# EAGLE schematic Servosolenoidvalve_of_Tatebayashi (EAGLE 9.6.2)

## Sheet 1 of 3
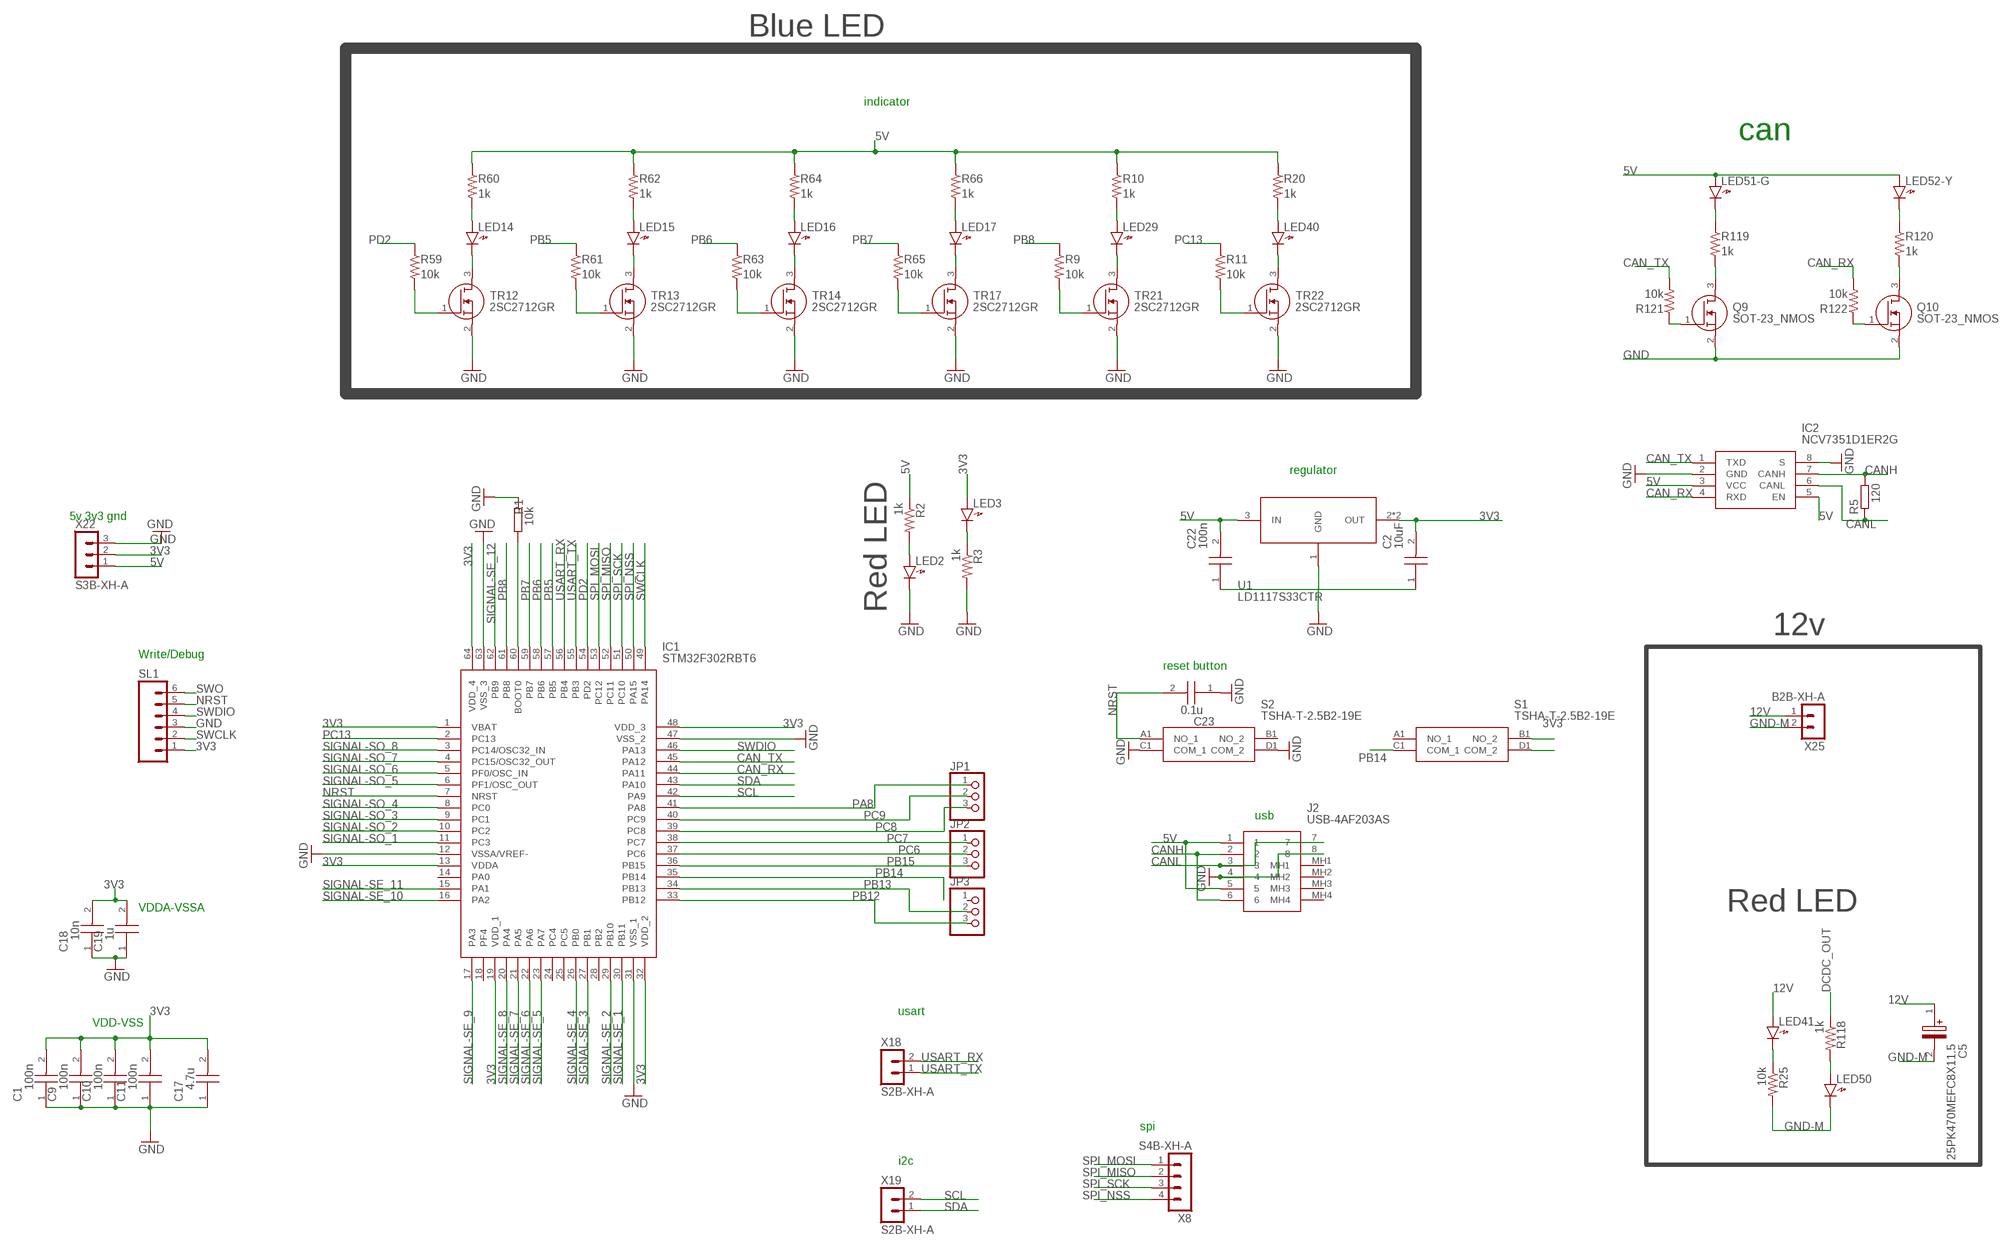
[diagram p0: schematic, sheet 1]

### Parts
C1  100n  AMK107BBJ476MA-RE  [CAPC1709X100N]
C2  10uF  GRM188B31A106KE69D  [CAPC1608X90N]
C5  25PK470MEFC8X11.5  [CAPPRD350W60D825H1150]
C9  100n  AMK107BBJ476MA-RE  [CAPC1709X100N]
C10  100n  AMK107BBJ476MA-RE  [CAPC1709X100N]
C11  100n  AMK107BBJ476MA-RE  [CAPC1709X100N]
C17  4.7u  AMK107BBJ476MA-RE  [CAPC1709X100N]
C18  10n  AMK107BBJ476MA-RE  [CAPC1709X100N]
C19  1u  AMK107BBJ476MA-RE  [CAPC1709X100N]
C22  100n  GRM188B31A106KE69D  [CAPC1608X90N]
C23  0.1u  AMK107BBJ476MA-RE  [CAPC1709X100N]
IC1  STM32F302RBT6  [QFP50P1200X1200X160-64N]
IC2  NCV7351D1ER2G  [SOIC127P600X175-8N]
J2  USB-4AF203AS  [USB4AF203AS]
JP1  PINHD-1X3  [1X03]
JP2  PINHD-1X3  [1X03]
JP3  PINHD-1X3  [1X03]
LED2  LED1608  [LED1608]
LED3  LED1608  [LED1608]
LED14  LED1608  [LED1608]
LED15  LED1608  [LED1608]
LED16  LED1608  [LED1608]
LED17  LED1608  [LED1608]
LED29  LED1608  [LED1608]
LED40  LED1608  [LED1608]
LED41  LED1608  [LED1608]
LED50  LED1608  [LED1608]
LED51-G  LED1608  [LED1608]
LED52-Y  LED1608  [LED1608]
Q9  SOT-23_NMOS  [SOT-23]
Q10  SOT-23_NMOS  [SOT-23]
R1  10k  R1608  [1608]
R2  1k  R-US_R0603  [R0603]
R3  1k  R-US_R0603  [R0603]
R5  120  R-EU_R0805  [R0805]
R9  10k  RESISTOR-US1608  [SMD1608]
R10  1k  RESISTOR-US1608  [SMD1608]
R11  10k  RESISTOR-US1608  [SMD1608]
R20  1k  RESISTOR-US1608  [SMD1608]
R25  10k  R-US_R0603  [R0603]
R59  10k  RESISTOR-US1608  [SMD1608]
R60  1k  RESISTOR-US1608  [SMD1608]
R61  10k  RESISTOR-US1608  [SMD1608]
R62  1k  RESISTOR-US1608  [SMD1608]
R63  10k  RESISTOR-US1608  [SMD1608]
R64  1k  RESISTOR-US1608  [SMD1608]
R65  10k  RESISTOR-US1608  [SMD1608]
R66  1k  RESISTOR-US1608  [SMD1608]
R118  1k  R-US_R0603  [R0603]
R119  1k  RESISTOR-US1608  [SMD1608]
R120  1k  RESISTOR-US1608  [SMD1608]
R121  10k  RESISTOR-US1608  [SMD1608]
R122  10k  RESISTOR-US1608  [SMD1608]
S1  TSHA-T-2.5B2-19E  [TSHAT25B219E]
S2  TSHA-T-2.5B2-19E  [TSHAT25B219E]
SL1  MA06  [06PA]
TR12  2SC2712GR  SOT-23_NMOS  [SOT-23]
TR13  2SC2712GR  SOT-23_NMOS  [SOT-23]
TR14  2SC2712GR  SOT-23_NMOS  [SOT-23]
TR17  2SC2712GR  SOT-23_NMOS  [SOT-23]
TR21  2SC2712GR  SOT-23_NMOS  [SOT-23]
TR22  2SC2712GR  SOT-23_NMOS  [SOT-23]
U1  LD1117S33CTR  [SOT223]
X8  S4B-XH-A  [S4B-XH-A]
X18  S2B-XH-A  [S2B-XH-A]
X19  S2B-XH-A  [S2B-XH-A]
X22  S3B-XH-A  [S3B-XH-A]
X25  B2B-XH-A  [B2B-XH-A]

### Nets
3V3: C1.2 C2.2 C9.2 C10.2 C11.2 C17.2 C18.2 C19.2 IC1.1(VBAT) IC1.13(VDDA) IC1.19(VDD_1) IC1.32(VDD_2) IC1.48(VDD_3) IC1.64(VDD_4) LED3.A S1.B1(NO_2) SL1.1 U1.2(OUT) U1.4(OUT) X22.2 ; also sheet 2,3
5V: C22.2 IC2.3(VCC) IC2.5(EN) J2.1 J2.5 LED51-G.A LED52-Y.A R2.1 R10.1 R20.1 R60.1 R62.1 R64.1 R66.1 U1.3(IN) X22.1
12V: C5.1(+) LED41.A X25.1 ; also sheet 2
CAN_RX: IC1.44(PA11) IC2.4(RXD) R122.2
CAN_TX: IC1.45(PA12) IC2.1(TXD) R121.2
CANH: IC2.7(CANH) J2.2 J2.6 R5.2
CANL: IC2.6(CANL) J2.3 J2.7 R5.1
DCDC_OUT: R118.1 ; also sheet 3
GND: C1.1 C2.1 C9.1 C10.1 C11.1 C17.1 C18.1 C19.1 C22.1 C23.1 IC1.12(VSSA/VREF-) IC1.31(VSS_1) IC1.47(VSS_2) IC1.63(VSS_3) IC2.2(GND) IC2.8(S) J2.4 J2.8 LED2.K Q9.2(S) Q10.2(S) R1.2 R3.2 S2.C1(COM_1) S2.D1(COM_2) SL1.3 TR12.2(S) TR13.2(S) TR14.2(S) TR17.2(S) TR21.2(S) TR22.2(S) U1.1(GND) X22.3 ; also sheet 2,3
GND-M: C5.2(-) LED50.K R25.2 X25.2 ; also sheet 2,3
N$7: LED2.A R2.2
N$8: LED3.K R3.1
N$15: IC1.60(BOOT0) R1.1
N$55: R59.2 TR12.1(G)
N$56: LED14.K TR12.3(D)
N$57: LED14.A R60.2
N$58: R61.2 TR13.1(G)
N$59: LED15.K TR13.3(D)
N$60: LED15.A R62.2
N$61: R63.2 TR14.1(G)
N$62: LED16.K TR14.3(D)
N$63: LED16.A R64.2
N$64: R65.2 TR17.1(G)
N$65: LED17.K TR17.3(D)
N$66: LED17.A R66.2
N$84: R9.2 TR21.1(G)
N$86: LED29.K TR21.3(D)
N$88: LED29.A R10.2
N$89: R11.2 TR22.1(G)
N$90: LED40.K TR22.3(D)
N$91: LED40.A R20.2
N$92: LED41.K R25.1
N$103: Q9.1(G) R121.1
N$104: Q10.1(G) R122.1
N$105: LED51-G.K R119.1
N$106: LED52-Y.K R120.1
N$107: LED50.A R118.2
N$108: Q9.3(D) R119.2
N$109: Q10.3(D) R120.2
N$113: S1.D1(COM_2)
NRST: C23.2 IC1.7(NRST) S2.A1(NO_1) SL1.5
PA8: IC1.41(PA8) JP1.1
PB5: IC1.57(PB5) R61.1
PB6: IC1.58(PB6) R63.1
PB7: IC1.59(PB7) R65.1
PB8: IC1.61(PB8) R9.1
PB12: IC1.33(PB12) JP3.3
PB13: IC1.34(PB13) JP3.2
PB14: IC1.35(PB14) S1.C1(COM_1)
PB15: IC1.36(PB15) JP2.3
PC6: IC1.37(PC6) JP2.2
PC7: IC1.38(PC7) JP2.1
PC8: IC1.39(PC8) JP1.3
PC9: IC1.40(PC9) JP1.2
PC13: IC1.2(PC13) R11.1
PD2: IC1.54(PD2) R59.1
SCL: IC1.42(PA9) X19.2
SDA: IC1.43(PA10) X19.1
SIGNAL-SE_1: IC1.30(PB11) ; also sheet 3
SIGNAL-SE_2: IC1.29(PB10) ; also sheet 3
SIGNAL-SE_3: IC1.27(PB1) ; also sheet 3
SIGNAL-SE_4: IC1.26(PB0) ; also sheet 3
SIGNAL-SE_5: IC1.23(PA7) ; also sheet 3
SIGNAL-SE_6: IC1.22(PA6) ; also sheet 3
SIGNAL-SE_7: IC1.21(PA5) ; also sheet 3
SIGNAL-SE_8: IC1.20(PA4) ; also sheet 3
SIGNAL-SE_9: IC1.17(PA3) ; also sheet 3
SIGNAL-SE_10: IC1.16(PA2) ; also sheet 3
SIGNAL-SE_11: IC1.15(PA1) ; also sheet 3
SIGNAL-SE_12: IC1.62(PB9) ; also sheet 3
SIGNAL-SO_1: IC1.11(PC3) ; also sheet 2
SIGNAL-SO_2: IC1.10(PC2) ; also sheet 2
SIGNAL-SO_3: IC1.9(PC1) ; also sheet 2
SIGNAL-SO_4: IC1.8(PC0) ; also sheet 2
SIGNAL-SO_5: IC1.6(PF1/OSC_OUT) ; also sheet 2
SIGNAL-SO_6: IC1.5(PF0/OSC_IN) ; also sheet 2
SIGNAL-SO_7: IC1.4(PC15/OSC32_OUT) ; also sheet 2
SIGNAL-SO_8: IC1.3(PC14/OSC32_IN) ; also sheet 2
SPI_MISO: IC1.52(PC11) X8.2
SPI_MOSI: IC1.53(PC12) X8.1
SPI_NSS: IC1.50(PA15) X8.4
SPI_SCK: IC1.51(PC10) X8.3
SWCLK: IC1.49(PA14) SL1.2
SWDIO: IC1.46(PA13) SL1.4
SWO: SL1.6
USART_RX: IC1.56(PB4) X18.2
USART_TX: IC1.55(PB3) X18.1
Unconnected: IC1.14(PA0) IC1.18(PF4) IC1.24(PC4) IC1.25(PC5) IC1.28(PB2) J2.MH1 J2.MH2 J2.MH3 J2.MH4 JP3.1 S1.A1(NO_1) S2.B1(NO_2)

### Notes on the sheet
- Blue LED
- indicator
- can
- regulator
- 5v 3v3 gnd
- Red LED
- 12v
- Write/Debug
- reset button
- usb
- VDDA-VSSA | Red LED
- usart
- VDD-VSS
- spi
- i2c

## Sheet 2 of 3
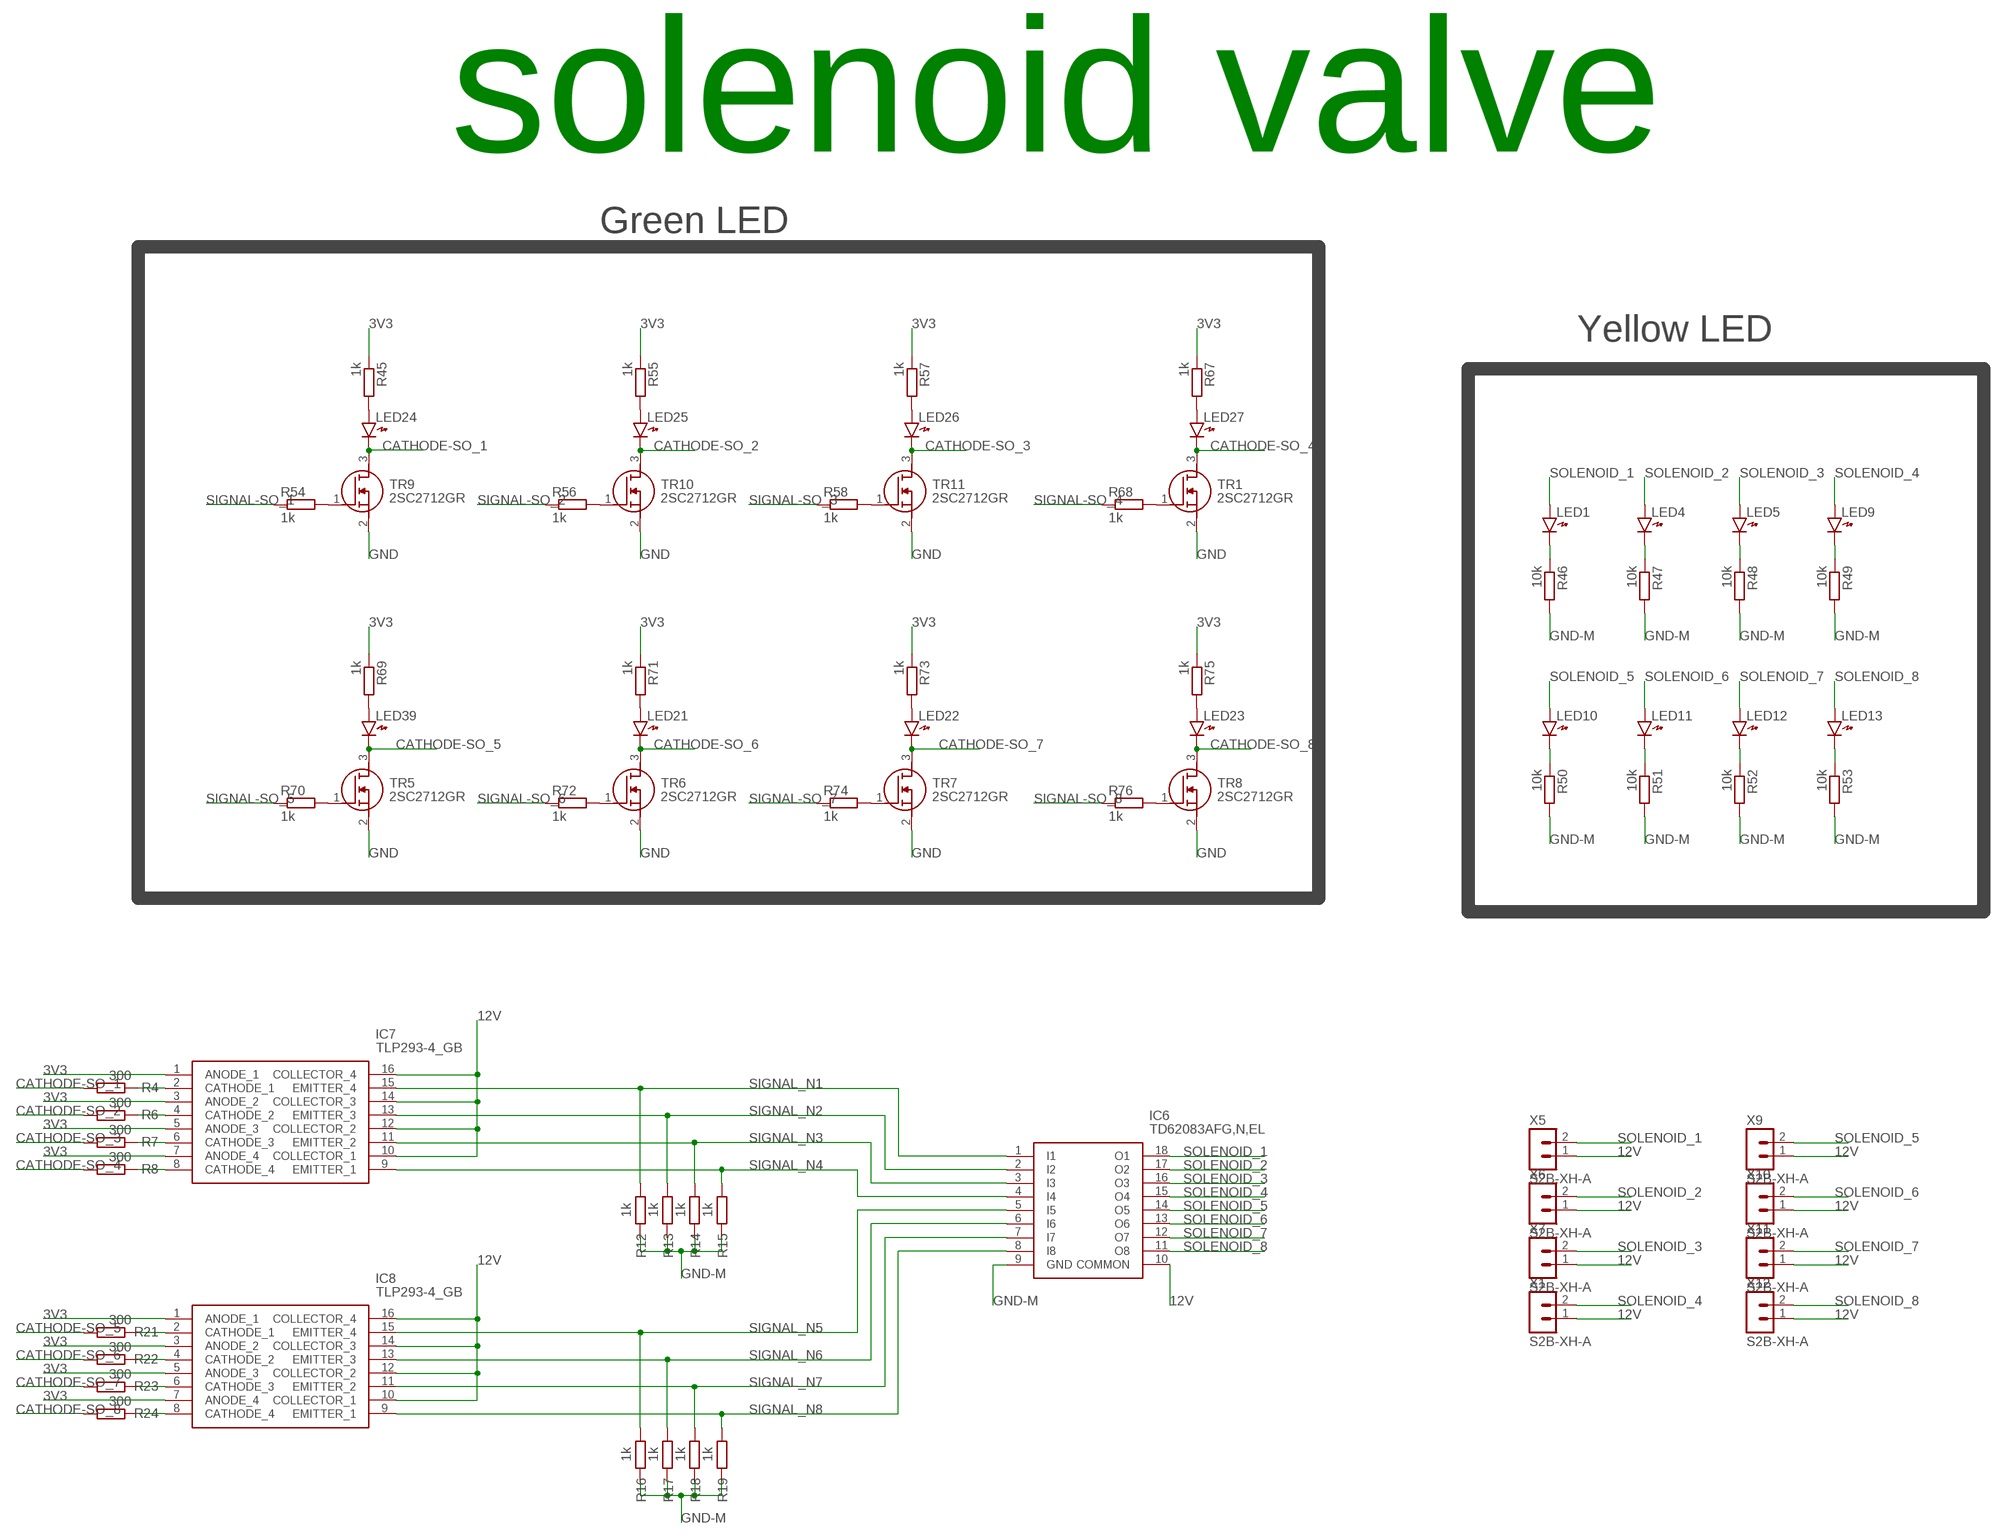
[diagram p1: schematic, sheet 2]

### Parts
IC6  TD62083AFG,N,EL  [SOIC127P1030X245-18N]
IC7  TLP293-4_GB  [SOP128P700X220-16N]
IC8  TLP293-4_GB  [SOP128P700X220-16N]
LED1  LED1608  [LED1608]
LED4  LED1608  [LED1608]
LED5  LED1608  [LED1608]
LED9  LED1608  [LED1608]
LED10  LED1608  [LED1608]
LED11  LED1608  [LED1608]
LED12  LED1608  [LED1608]
LED13  LED1608  [LED1608]
LED21  LED1608  [LED1608]
LED22  LED1608  [LED1608]
LED23  LED1608  [LED1608]
LED24  LED1608  [LED1608]
LED25  LED1608  [LED1608]
LED26  LED1608  [LED1608]
LED27  LED1608  [LED1608]
LED39  LED1608  [LED1608]
R4  300  R-EU_R0603  [R0603]
R6  300  R-EU_R0603  [R0603]
R7  300  R-EU_R0603  [R0603]
R8  300  R-EU_R0603  [R0603]
R12  1k  R-EU_R0603  [R0603]
R13  1k  R-EU_R0603  [R0603]
R14  1k  R-EU_R0603  [R0603]
R15  1k  R-EU_R0603  [R0603]
R16  1k  R-EU_R0603  [R0603]
R17  1k  R-EU_R0603  [R0603]
R18  1k  R-EU_R0603  [R0603]
R19  1k  R-EU_R0603  [R0603]
R21  300  R-EU_R0603  [R0603]
R22  300  R-EU_R0603  [R0603]
R23  300  R-EU_R0603  [R0603]
R24  300  R-EU_R0603  [R0603]
R45  1k  R-EU_R0603  [R0603]
R46  10k  R-EU_R0603  [R0603]
R47  10k  R-EU_R0603  [R0603]
R48  10k  R-EU_R0603  [R0603]
R49  10k  R-EU_R0603  [R0603]
R50  10k  R-EU_R0603  [R0603]
R51  10k  R-EU_R0603  [R0603]
R52  10k  R-EU_R0603  [R0603]
R53  10k  R-EU_R0603  [R0603]
R54  1k  R-EU_R0603  [R0603]
R55  1k  R-EU_R0603  [R0603]
R56  1k  R-EU_R0603  [R0603]
R57  1k  R-EU_R0603  [R0603]
R58  1k  R-EU_R0603  [R0603]
R67  1k  R-EU_R0603  [R0603]
R68  1k  R-EU_R0603  [R0603]
R69  1k  R-EU_R0603  [R0603]
R70  1k  R-EU_R0603  [R0603]
R71  1k  R-EU_R0603  [R0603]
R72  1k  R-EU_R0603  [R0603]
R73  1k  R-EU_R0603  [R0603]
R74  1k  R-EU_R0603  [R0603]
R75  1k  R-EU_R0603  [R0603]
R76  1k  R-EU_R0603  [R0603]
TR1  2SC2712GR  SOT-23_NMOS  [SOT-23]
TR5  2SC2712GR  SOT-23_NMOS  [SOT-23]
TR6  2SC2712GR  SOT-23_NMOS  [SOT-23]
TR7  2SC2712GR  SOT-23_NMOS  [SOT-23]
TR8  2SC2712GR  SOT-23_NMOS  [SOT-23]
TR9  2SC2712GR  SOT-23_NMOS  [SOT-23]
TR10  2SC2712GR  SOT-23_NMOS  [SOT-23]
TR11  2SC2712GR  SOT-23_NMOS  [SOT-23]
X1  S2B-XH-A  [S2B-XH-A]
X5  S2B-XH-A  [S2B-XH-A]
X6  S2B-XH-A  [S2B-XH-A]
X7  S2B-XH-A  [S2B-XH-A]
X9  S2B-XH-A  [S2B-XH-A]
X10  S2B-XH-A  [S2B-XH-A]
X11  S2B-XH-A  [S2B-XH-A]
X12  S2B-XH-A  [S2B-XH-A]

### Nets
3V3: IC7.1(ANODE_1) IC7.3(ANODE_2) IC7.5(ANODE_3) IC7.7(ANODE_4) IC8.1(ANODE_1) IC8.3(ANODE_2) IC8.5(ANODE_3) IC8.7(ANODE_4) R45.1 R55.1 R57.1 R67.1 R69.1 R71.1 R73.1 R75.1 ; also sheet 1,3
12V: IC6.10(COMMON) IC7.10(COLLECTOR_1) IC7.12(COLLECTOR_2) IC7.14(COLLECTOR_3) IC7.16(COLLECTOR_4) IC8.10(COLLECTOR_1) IC8.12(COLLECTOR_2) IC8.14(COLLECTOR_3) IC8.16(COLLECTOR_4) X1.1 X5.1 X6.1 X7.1 X9.1 X10.1 X11.1 X12.1 ; also sheet 1
CATHODE-SO_1: LED24.K R4.2 TR9.3(D)
CATHODE-SO_2: LED25.K R6.2 TR10.3(D)
CATHODE-SO_3: LED26.K R7.2 TR11.3(D)
CATHODE-SO_4: LED27.K R8.2 TR1.3(D)
CATHODE-SO_5: LED39.K R21.2 TR5.3(D)
CATHODE-SO_6: LED21.K R22.2 TR6.3(D)
CATHODE-SO_7: LED22.K R23.2 TR7.3(D)
CATHODE-SO_8: LED23.K R24.2 TR8.3(D)
GND: TR1.2(S) TR5.2(S) TR6.2(S) TR7.2(S) TR8.2(S) TR9.2(S) TR10.2(S) TR11.2(S) ; also sheet 1,3
GND-M: IC6.9(GND) R12.1 R13.1 R14.1 R15.1 R16.1 R17.1 R18.1 R19.1 R46.2 R47.2 R48.2 R49.2 R50.2 R51.2 R52.2 R53.2 ; also sheet 1,3
N$4: IC7.2(CATHODE_1) R4.1
N$5: IC7.4(CATHODE_2) R6.1
N$6: IC7.6(CATHODE_3) R7.1
N$10: IC7.8(CATHODE_4) R8.1
N$11: LED24.A R45.2
N$12: LED25.A R55.2
N$13: LED26.A R57.2
N$14: LED27.A R67.2
N$16: IC8.2(CATHODE_1) R21.1
N$17: IC8.4(CATHODE_2) R22.1
N$18: R54.2 TR9.1(G)
N$19: LED39.A R69.2
N$20: R68.2 TR1.1(G)
N$21: LED21.A R71.2
N$22: IC8.6(CATHODE_3) R23.1
N$23: IC8.8(CATHODE_4) R24.1
N$24: LED22.A R73.2
N$25: LED23.A R75.2
N$32: R70.2 TR5.1(G)
N$34: R72.2 TR6.1(G)
N$35: R74.2 TR7.1(G)
N$39: R76.2 TR8.1(G)
N$41: R56.2 TR10.1(G)
N$44: R58.2 TR11.1(G)
N$45: LED1.K R46.1
N$46: LED4.K R47.1
N$47: LED5.K R48.1
N$48: LED9.K R49.1
N$49: LED10.K R50.1
N$50: LED11.K R51.1
N$51: LED12.K R52.1
N$52: LED13.K R53.1
SIGNAL-SO_1: R54.1 ; also sheet 1
SIGNAL-SO_2: R56.1 ; also sheet 1
SIGNAL-SO_3: R58.1 ; also sheet 1
SIGNAL-SO_4: R68.1 ; also sheet 1
SIGNAL-SO_5: R70.1 ; also sheet 1
SIGNAL-SO_6: R72.1 ; also sheet 1
SIGNAL-SO_7: R74.1 ; also sheet 1
SIGNAL-SO_8: R76.1 ; also sheet 1
SIGNAL_N1: IC6.1(I1) IC7.15(EMITTER_4) R12.2
SIGNAL_N2: IC6.2(I2) IC7.13(EMITTER_3) R13.2
SIGNAL_N3: IC6.3(I3) IC7.11(EMITTER_2) R14.2
SIGNAL_N4: IC6.4(I4) IC7.9(EMITTER_1) R15.2
SIGNAL_N5: IC6.5(I5) IC8.15(EMITTER_4) R16.2
SIGNAL_N6: IC6.6(I6) IC8.13(EMITTER_3) R17.2
SIGNAL_N7: IC6.7(I7) IC8.11(EMITTER_2) R18.2
SIGNAL_N8: IC6.8(I8) IC8.9(EMITTER_1) R19.2
SOLENOID_1: IC6.18(O1) LED1.A X5.2
SOLENOID_2: IC6.17(O2) LED4.A X6.2
SOLENOID_3: IC6.16(O3) LED5.A X7.2
SOLENOID_4: IC6.15(O4) LED9.A X1.2
SOLENOID_5: IC6.14(O5) LED10.A X9.2
SOLENOID_6: IC6.13(O6) LED11.A X10.2
SOLENOID_7: IC6.12(O7) LED12.A X11.2
SOLENOID_8: IC6.11(O8) LED13.A X12.2

### Notes on the sheet
- solenoid valve
- Green LED
- Yellow LED

## Sheet 3 of 3
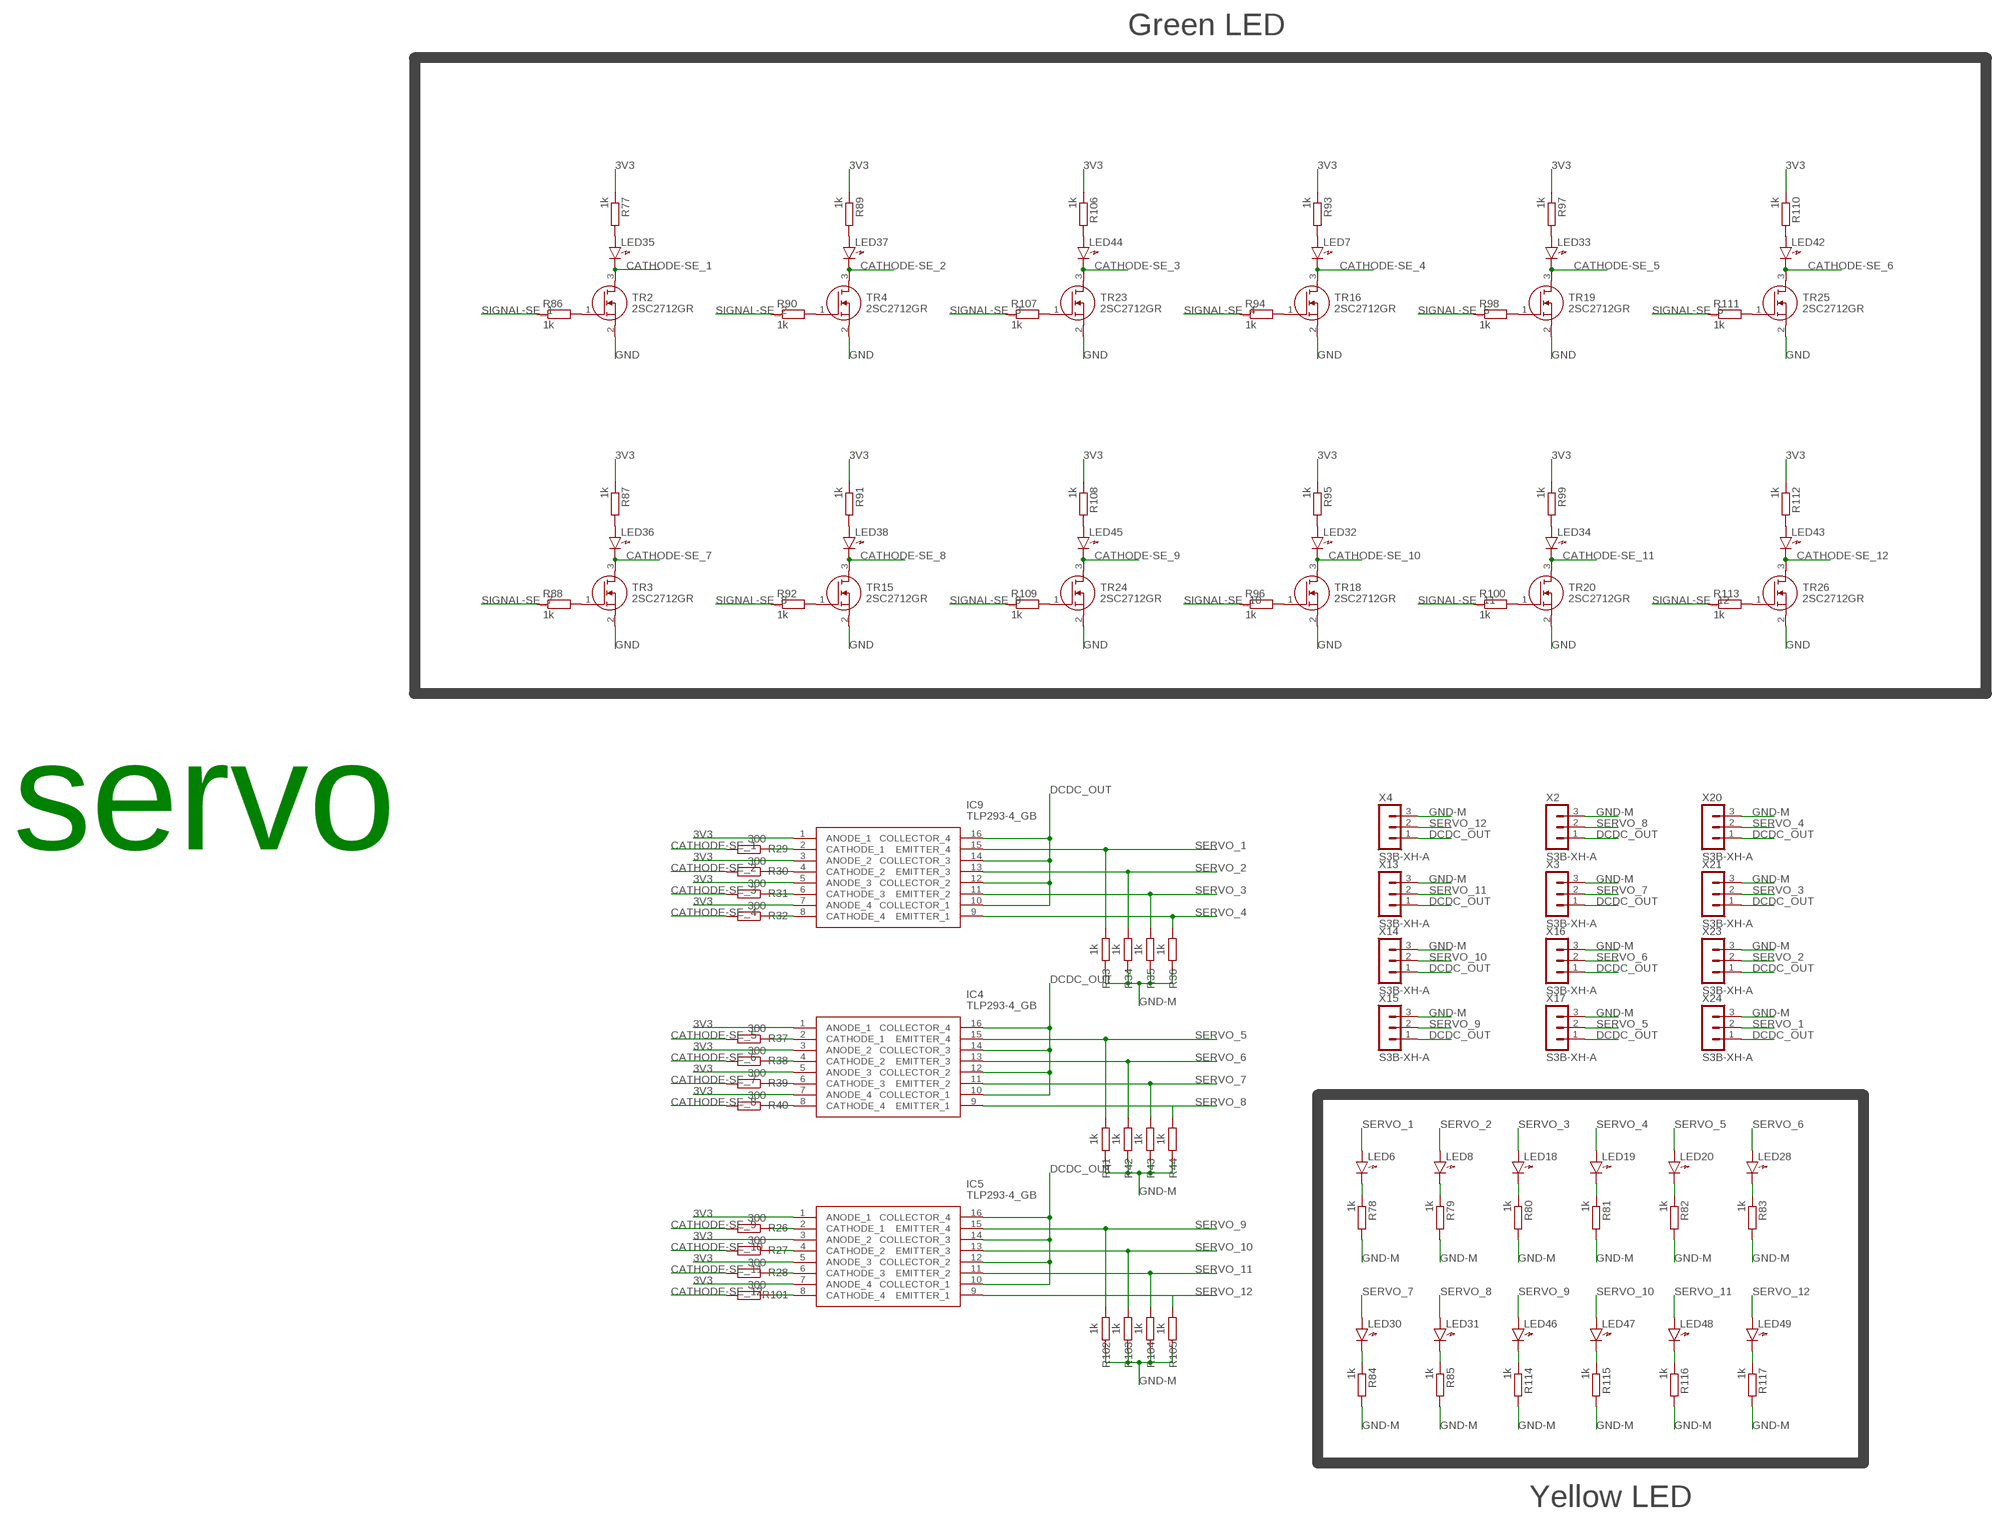
[diagram p2: schematic, sheet 3]

### Parts
IC4  TLP293-4_GB  [SOP128P700X220-16N]
IC5  TLP293-4_GB  [SOP128P700X220-16N]
IC9  TLP293-4_GB  [SOP128P700X220-16N]
LED6  LED1608  [LED1608]
LED7  LED1608  [LED1608]
LED8  LED1608  [LED1608]
LED18  LED1608  [LED1608]
LED19  LED1608  [LED1608]
LED20  LED1608  [LED1608]
LED28  LED1608  [LED1608]
LED30  LED1608  [LED1608]
LED31  LED1608  [LED1608]
LED32  LED1608  [LED1608]
LED33  LED1608  [LED1608]
LED34  LED1608  [LED1608]
LED35  LED1608  [LED1608]
LED36  LED1608  [LED1608]
LED37  LED1608  [LED1608]
LED38  LED1608  [LED1608]
LED42  LED1608  [LED1608]
LED43  LED1608  [LED1608]
LED44  LED1608  [LED1608]
LED45  LED1608  [LED1608]
LED46  LED1608  [LED1608]
LED47  LED1608  [LED1608]
LED48  LED1608  [LED1608]
LED49  LED1608  [LED1608]
R26  300  R-EU_R0603  [R0603]
R27  300  R-EU_R0603  [R0603]
R28  300  R-EU_R0603  [R0603]
R29  300  R-EU_R0603  [R0603]
R30  300  R-EU_R0603  [R0603]
R31  300  R-EU_R0603  [R0603]
R32  300  R-EU_R0603  [R0603]
R33  1k  R-EU_R0603  [R0603]
R34  1k  R-EU_R0603  [R0603]
R35  1k  R-EU_R0603  [R0603]
R36  1k  R-EU_R0603  [R0603]
R37  300  R-EU_R0603  [R0603]
R38  300  R-EU_R0603  [R0603]
R39  300  R-EU_R0603  [R0603]
R40  300  R-EU_R0603  [R0603]
R41  1k  R-EU_R0603  [R0603]
R42  1k  R-EU_R0603  [R0603]
R43  1k  R-EU_R0603  [R0603]
R44  1k  R-EU_R0603  [R0603]
R77  1k  R-EU_R0603  [R0603]
R78  1k  R-EU_R0603  [R0603]
R79  1k  R-EU_R0603  [R0603]
R80  1k  R-EU_R0603  [R0603]
R81  1k  R-EU_R0603  [R0603]
R82  1k  R-EU_R0603  [R0603]
R83  1k  R-EU_R0603  [R0603]
R84  1k  R-EU_R0603  [R0603]
R85  1k  R-EU_R0603  [R0603]
R86  1k  R-EU_R0603  [R0603]
R87  1k  R-EU_R0603  [R0603]
R88  1k  R-EU_R0603  [R0603]
R89  1k  R-EU_R0603  [R0603]
R90  1k  R-EU_R0603  [R0603]
R91  1k  R-EU_R0603  [R0603]
R92  1k  R-EU_R0603  [R0603]
R93  1k  R-EU_R0603  [R0603]
R94  1k  R-EU_R0603  [R0603]
R95  1k  R-EU_R0603  [R0603]
R96  1k  R-EU_R0603  [R0603]
R97  1k  R-EU_R0603  [R0603]
R98  1k  R-EU_R0603  [R0603]
R99  1k  R-EU_R0603  [R0603]
R100  1k  R-EU_R0603  [R0603]
R101  300  R-EU_R0603  [R0603]
R102  1k  R-EU_R0603  [R0603]
R103  1k  R-EU_R0603  [R0603]
R104  1k  R-EU_R0603  [R0603]
R105  1k  R-EU_R0603  [R0603]
R106  1k  R-EU_R0603  [R0603]
R107  1k  R-EU_R0603  [R0603]
R108  1k  R-EU_R0603  [R0603]
R109  1k  R-EU_R0603  [R0603]
R110  1k  R-EU_R0603  [R0603]
R111  1k  R-EU_R0603  [R0603]
R112  1k  R-EU_R0603  [R0603]
R113  1k  R-EU_R0603  [R0603]
R114  1k  R-EU_R0603  [R0603]
R115  1k  R-EU_R0603  [R0603]
R116  1k  R-EU_R0603  [R0603]
R117  1k  R-EU_R0603  [R0603]
TR2  2SC2712GR  SOT-23_NMOS  [SOT-23]
TR3  2SC2712GR  SOT-23_NMOS  [SOT-23]
TR4  2SC2712GR  SOT-23_NMOS  [SOT-23]
TR15  2SC2712GR  SOT-23_NMOS  [SOT-23]
TR16  2SC2712GR  SOT-23_NMOS  [SOT-23]
TR18  2SC2712GR  SOT-23_NMOS  [SOT-23]
TR19  2SC2712GR  SOT-23_NMOS  [SOT-23]
TR20  2SC2712GR  SOT-23_NMOS  [SOT-23]
TR23  2SC2712GR  SOT-23_NMOS  [SOT-23]
TR24  2SC2712GR  SOT-23_NMOS  [SOT-23]
TR25  2SC2712GR  SOT-23_NMOS  [SOT-23]
TR26  2SC2712GR  SOT-23_NMOS  [SOT-23]
X2  S3B-XH-A  [S3B-XH-A]
X3  S3B-XH-A  [S3B-XH-A]
X4  S3B-XH-A  [S3B-XH-A]
X13  S3B-XH-A  [S3B-XH-A]
X14  S3B-XH-A  [S3B-XH-A]
X15  S3B-XH-A  [S3B-XH-A]
X16  S3B-XH-A  [S3B-XH-A]
X17  S3B-XH-A  [S3B-XH-A]
X20  S3B-XH-A  [S3B-XH-A]
X21  S3B-XH-A  [S3B-XH-A]
X23  S3B-XH-A  [S3B-XH-A]
X24  S3B-XH-A  [S3B-XH-A]

### Nets
3V3: IC4.1(ANODE_1) IC4.3(ANODE_2) IC4.5(ANODE_3) IC4.7(ANODE_4) IC5.1(ANODE_1) IC5.3(ANODE_2) IC5.5(ANODE_3) IC5.7(ANODE_4) IC9.1(ANODE_1) IC9.3(ANODE_2) IC9.5(ANODE_3) IC9.7(ANODE_4) R77.1 R87.1 R89.1 R91.1 R93.1 R95.1 R97.1 R99.1 R106.1 R108.1 R110.1 R112.1 ; also sheet 1,2
CATHODE-SE_1: LED35.K R29.2 TR2.3(D)
CATHODE-SE_2: LED37.K R30.2 TR4.3(D)
CATHODE-SE_3: LED44.K R31.2 TR23.3(D)
CATHODE-SE_4: LED7.K R32.2 TR16.3(D)
CATHODE-SE_5: LED33.K R37.2 TR19.3(D)
CATHODE-SE_6: LED42.K R38.2 TR25.3(D)
CATHODE-SE_7: LED36.K R39.2 TR3.3(D)
CATHODE-SE_8: LED38.K R40.2 TR15.3(D)
CATHODE-SE_9: LED45.K R26.2 TR24.3(D)
CATHODE-SE_10: LED32.K R27.2 TR18.3(D)
CATHODE-SE_11: LED34.K R28.2 TR20.3(D)
CATHODE-SE_12: LED43.K R101.2 TR26.3(D)
DCDC_OUT: IC4.10(COLLECTOR_1) IC4.12(COLLECTOR_2) IC4.14(COLLECTOR_3) IC4.16(COLLECTOR_4) IC5.10(COLLECTOR_1) IC5.12(COLLECTOR_2) IC5.14(COLLECTOR_3) IC5.16(COLLECTOR_4) IC9.10(COLLECTOR_1) IC9.12(COLLECTOR_2) IC9.14(COLLECTOR_3) IC9.16(COLLECTOR_4) X2.1 X3.1 X4.1 X13.1 X14.1 X15.1 X16.1 X17.1 X20.1 X21.1 X23.1 X24.1 ; also sheet 1
GND: TR2.2(S) TR3.2(S) TR4.2(S) TR15.2(S) TR16.2(S) TR18.2(S) TR19.2(S) TR20.2(S) TR23.2(S) TR24.2(S) TR25.2(S) TR26.2(S) ; also sheet 1,2
GND-M: R33.1 R34.1 R35.1 R36.1 R41.1 R42.1 R43.1 R44.1 R78.2 R79.2 R80.2 R81.2 R82.2 R83.2 R84.2 R85.2 R102.1 R103.1 R104.1 R105.1 R114.2 R115.2 R116.2 R117.2 X2.3 X3.3 X4.3 X13.3 X14.3 X15.3 X16.3 X17.3 X20.3 X21.3 X23.3 X24.3 ; also sheet 1,2
N$1: IC4.2(CATHODE_1) R37.1
N$2: IC4.4(CATHODE_2) R38.1
N$3: IC4.6(CATHODE_3) R39.1
N$9: IC4.8(CATHODE_4) R40.1
N$26: R86.2 TR2.1(G)
N$27: R88.2 TR3.1(G)
N$28: IC9.2(CATHODE_1) R29.1
N$29: IC9.4(CATHODE_2) R30.1
N$30: IC9.6(CATHODE_3) R31.1
N$31: IC9.8(CATHODE_4) R32.1
N$33: R90.2 TR4.1(G)
N$36: R92.2 TR15.1(G)
N$37: R94.2 TR16.1(G)
N$38: R96.2 TR18.1(G)
N$40: R98.2 TR19.1(G)
N$42: R100.2 TR20.1(G)
N$43: IC5.2(CATHODE_1) R26.1
N$53: LED6.K R78.1
N$54: LED8.K R79.1
N$67: LED18.K R80.1
N$68: LED19.K R81.1
N$69: LED20.K R82.1
N$70: LED28.K R83.1
N$71: LED30.K R84.1
N$72: LED31.K R85.1
N$73: LED35.A R77.2
N$74: IC5.4(CATHODE_2) R27.1
N$75: LED36.A R87.2
N$76: IC5.6(CATHODE_3) R28.1
N$77: LED37.A R89.2
N$78: IC5.8(CATHODE_4) R101.1
N$79: LED38.A R91.2
N$80: LED7.A R93.2
N$81: LED32.A R95.2
N$82: LED33.A R97.2
N$83: LED34.A R99.2
N$85: R107.2 TR23.1(G)
N$87: R109.2 TR24.1(G)
N$93: R111.2 TR25.1(G)
N$94: R113.2 TR26.1(G)
N$95: LED44.A R106.2
N$96: LED45.A R108.2
N$97: LED42.A R110.2
N$98: LED43.A R112.2
N$99: LED46.K R114.1
N$100: LED47.K R115.1
N$101: LED48.K R116.1
N$102: LED49.K R117.1
SERVO_1: IC9.15(EMITTER_4) LED6.A R33.2 X24.2
SERVO_2: IC9.13(EMITTER_3) LED8.A R34.2 X23.2
SERVO_3: IC9.11(EMITTER_2) LED18.A R35.2 X21.2
SERVO_4: IC9.9(EMITTER_1) LED19.A R36.2 X20.2
SERVO_5: IC4.15(EMITTER_4) LED20.A R41.2 X17.2
SERVO_6: IC4.13(EMITTER_3) LED28.A R42.2 X16.2
SERVO_7: IC4.11(EMITTER_2) LED30.A R43.2 X3.2
SERVO_8: IC4.9(EMITTER_1) LED31.A R44.2 X2.2
SERVO_9: IC5.15(EMITTER_4) LED46.A R102.2 X15.2
SERVO_10: IC5.13(EMITTER_3) LED47.A R103.2 X14.2
SERVO_11: IC5.11(EMITTER_2) LED48.A R104.2 X13.2
SERVO_12: IC5.9(EMITTER_1) LED49.A R105.2 X4.2
SIGNAL-SE_1: R86.1 ; also sheet 1
SIGNAL-SE_2: R90.1 ; also sheet 1
SIGNAL-SE_3: R107.1 ; also sheet 1
SIGNAL-SE_4: R94.1 ; also sheet 1
SIGNAL-SE_5: R98.1 ; also sheet 1
SIGNAL-SE_6: R111.1 ; also sheet 1
SIGNAL-SE_7: R88.1 ; also sheet 1
SIGNAL-SE_8: R92.1 ; also sheet 1
SIGNAL-SE_9: R109.1 ; also sheet 1
SIGNAL-SE_10: R96.1 ; also sheet 1
SIGNAL-SE_11: R100.1 ; also sheet 1
SIGNAL-SE_12: R113.1 ; also sheet 1

### Notes on the sheet
- Green LED
- servo
- Yellow LED

## Library data of the parts
C1 C9-C11 C17-C19 C23 = SamacSys_Parts:AMK107BBJ476MA-RE: 0603 (1608M) 47uF MLCC 4V dc +/-20% SMD Source: Datasheet <https://ds.yuden.co.jp/TYCOMPAS/ut/detail?pn=AMK107BBJ476MA-RE&u=M>; DESCRIPTION: 0603 (1608M) 47uF MLCC 4V dc +/-20% SMD; HEIGHT: 1mm; MANUFACTURER_NAME: TAIYO YUDEN; MANUFACTURER_PART_NUMBER: AMK107BBJ476MA-RE; MOUSER_PART_NUMBER: 963-AMK107BBJ476MARE; MOUSER_PRICE-STOCK: https://www.mouser.com/Search/Refine.aspx?Keyword=963-AMK107BBJ476MARE; RS_PART_NUMBER: 1843762P; RS_PRICE-STOCK: http://uk.rs-online.com/web/p/products/1843762P
C2 C22 = SamacSys_Parts:GRM188B31A106KE69D: Murata 1608 GRM 10000nF Ceramic Multilayer Capacitor, 10 V dc, +85C, B Dielectric, +/-10% Source: Datasheet <http://www.murata.com/~/media/webrenewal/support/library/catalog/products/capacitor/mlcc/c02e.pdf>; DESCRIPTION: Murata 1608 GRM 10000nF Ceramic Multilayer Capacitor, 10 V dc, +85C, B Dielectric, +/-10%; HEIGHT: 0.9mm; MANUFACTURER_NAME: Murata Electronics; MANUFACTURER_PART_NUMBER: GRM188B31A106KE69D; RS_PART_NUMBER: 8847157P; RS_PRICE-STOCK: http://uk.rs-online.com/web/p/products/8847157P
C5 = SamacSys_Parts:25PK470MEFC8X11.5: Rubycon 470uF 25 V dc Aluminium Electrolytic Capacitor, PK Series 2000h 8 Dia. x 11.5mm Source: Datasheet <http://www.rubycon.co.jp/en/catalog/e_pdfs/aluminum/e_pk.pdf>; DESCRIPTION: Rubycon 470uF 25 V dc Aluminium Electrolytic Capacitor, PK Series 2000h 8 Dia. x 11.5mm; HEIGHT: 11.5mm; MANUFACTURER_NAME: Rubycon; MANUFACTURER_PART_NUMBER: 25PK470MEFC8X11.5; MOUSER_PART_NUMBER: 232-25PK470MEFC8X115; MOUSER_PRICE-STOCK: https://www.mouser.co.uk/ProductDetail/Rubycon/25PK470MEFC8X115?qs=T3oQrply3y%252BFwMonqVFqXg%3D%3D
IC1 = SamacSys_Parts:STM32F302RBT6: STMicroelectronics, STM32F302RBT6 STM32F302RBT6, 32 bit ARM Cortex M4 MCU 72MHz 128 kB Flash, 32 kB RAM, USB CAN I2C 64-Pin LQFP Source: Datasheet <http://www.st.com/web/en/resource/technical/document/datasheet/DM00094064.pdf>; ARROW_PART_NUMBER: STM32F302RBT6; ARROW_PRICE-STOCK: https://www.arrow.com/en/products/stm32f302rbt6/stmicroelectronics; DESCRIPTION: STMicroelectronics, STM32F302RBT6 STM32F302RBT6, 32 bit ARM Cortex M4 MCU 72MHz 128 kB Flash, 32 kB RAM, USB CAN I2C 64-Pin LQFP; HEIGHT: 1.6mm; MANUFACTURER_NAME: STMicroelectronics; MANUFACTURER_PART_NUMBER: STM32F302RBT6; MOUSER_PART_NUMBER: 511-STM32F302RBT6; MOUSER_PRICE-STOCK: https://www.mouser.co.uk/ProductDetail/STMicroelectronics/STM32F302RBT6?qs=MgMGkPeFqc%252BEgXCc%2F%2FVW1w%3D%3D
IC2 = SamacSys_Parts:NCV7351D1ER2G: ON Semiconductor NCV7351D1ER2G, CAN Transceiver 1Mbit/s 1-channel ISO 11898-2, 8-Pin SOIC Source: Datasheet <http://www.onsemi.com/pub/Collateral/NCV7351-D.PDF>; ARROW_PART_NUMBER: NCV7351D1ER2G; ARROW_PRICE-STOCK: https://www.arrow.com/en/products/ncv7351d1er2g/on-semiconductor; DESCRIPTION: ON Semiconductor NCV7351D1ER2G, CAN Transceiver 1Mbit/s 1-channel ISO 11898-2, 8-Pin SOIC; HEIGHT: 1.75mm; MANUFACTURER_NAME: ON Semiconductor; MANUFACTURER_PART_NUMBER: NCV7351D1ER2G; MOUSER_PART_NUMBER: 863-NCV7351D1ER2G; MOUSER_PRICE-STOCK: https://www.mouser.co.uk/ProductDetail/ON-Semiconductor/NCV7351D1ER2G?qs=l5F7KFZg3O5tNFBk2wxDRg%3D%3D
IC4 IC5 IC7-IC9 = SamacSys_Parts:TLP293-4_GB: TOSHIBA - TLP293-4(GB - OPTOCOUPLER, PHOTOTRANS, 3.75KV, SOIC-16 Source: Datasheet <https://toshiba.semicon-storage.com/info/docget.jsp?did=15287&prodName=TLP293-4>; DESCRIPTION: TOSHIBA - TLP293-4(GB - OPTOCOUPLER, PHOTOTRANS, 3.75KV, SOIC-16; HEIGHT: 2.2mm; MANUFACTURER_NAME: Toshiba; MANUFACTURER_PART_NUMBER: TLP293-4(GB
IC6 = SamacSys_Parts:TD62083AFG,N,EL: Gate Drivers Source: Datasheet <http://toshiba.semicon-storage.com/info/docget.jsp?did=1577&prodName=TD62083AFG>; ARROW_PART_NUMBER: TD62083AFG,N,EL; ARROW_PRICE-STOCK: https://www.arrow.com/en/products/td62083afgnel/toshiba; DESCRIPTION: Gate Drivers; HEIGHT: 2.45mm; MANUFACTURER_NAME: Toshiba; MANUFACTURER_PART_NUMBER: TD62083AFG,N,EL; MOUSER_PART_NUMBER: N/A; MOUSER_PRICE-STOCK: https://www.mouser.co.uk/ProductDetail/Toshiba/TD62083AFGNEL?qs=rsevcuukUAxB55Ang1tTdQ%3D%3D
J2 = SamacSys_Parts:USB-4AF203AS: USB Connector, A type Female, Dual Port 4P x 2 Stacked, Right Angle type. Source: Datasheet <http://akizukidenshi.com/download/ds/useconn/USB-4AF203AS-CT.PDF>; DESCRIPTION: USB Connector, A type Female, Dual Port 4P x 2 Stacked, Right Angle type.; HEIGHT: 15.5mm; MANUFACTURER_NAME: Useconn Electronics; MANUFACTURER_PART_NUMBER: USB-4AF203AS
JP1-JP3 = pinhead:PINHD-1X3: PIN HEADER
LED1-LED50 LED51-G LED52-Y = generic:LED: Generic LEDs
Q9 Q10 TR1-TR26 = maya_smd:SOT-23_NMOS
R1 = 1608:R1608
R2 R3 R25 R118 = audio amplifier example:R-US_: RESISTOR, American symbol
R4-R8 R12-R19 R21-R24 R26-R58 R67-R117 = rcl:R-EU_: RESISTOR, European symbol; SPICEPREFIX: R
R9-R11 R20 R59-R66 R119-R122 = generic:RESISTOR-US: Generic Registor
S1 S2 = SamacSys_Parts:TSHA-T-2.5B2-19E: Switch Source: Datasheet <http://akizukidenshi.com/download/ds/topup/TSHA-T-2.5B2-19E.pdf>; DESCRIPTION: Switch; HEIGHT: 2.5mm; MANUFACTURER_NAME: Akizuki Denshi Tsusho; MANUFACTURER_PART_NUMBER: TSHA-T-2.5B2-19E
SL1 = con-amp-quick:MA06: AMP QUICK CONNECTOR; OC_FARNELL: unknown; OC_NEWARK: unknown
U1 = LD1117S33CTR:LD1117S33CTR: http://octopart.com/ld1117s33tr-stmicroelectronics-526708; AVAILABILITY: Unavailable; DESCRIPTION: LD1117 Series 1300 mA 3.3 V Fixed Output Positive Voltage LDO Regulator- SOT-223; MF: STMicroelectronics; MP: LD1117S33CTR; PACKAGE: SOT-223 STMicroelectronics; PRICE: None
X1 X5-X7 X9-X12 X18 X19 = con-JST_XH:S2B-XH: JST XH series header 2.50mm pitch disconnectable crimp style connectors, horizontal (side entry type), 2 pins
X2-X4 X13-X17 X20-X24 = con-JST_XH:S3B-XH: JST XH series header 2.50mm pitch disconnectable crimp style connectors, horizontal (side entry type), 3 pins
X8 = con-JST XH:S4B-XH: JST XH series header 2.50mm pitch disconnectable crimp style connectors, horizontal (side entry type), 4 pins
X25 = con-JST_XH:B2B-XH: JST XH series header 2.50mm pitch disconnectable crimp style connectors, vertical (side entry type), 2 pins